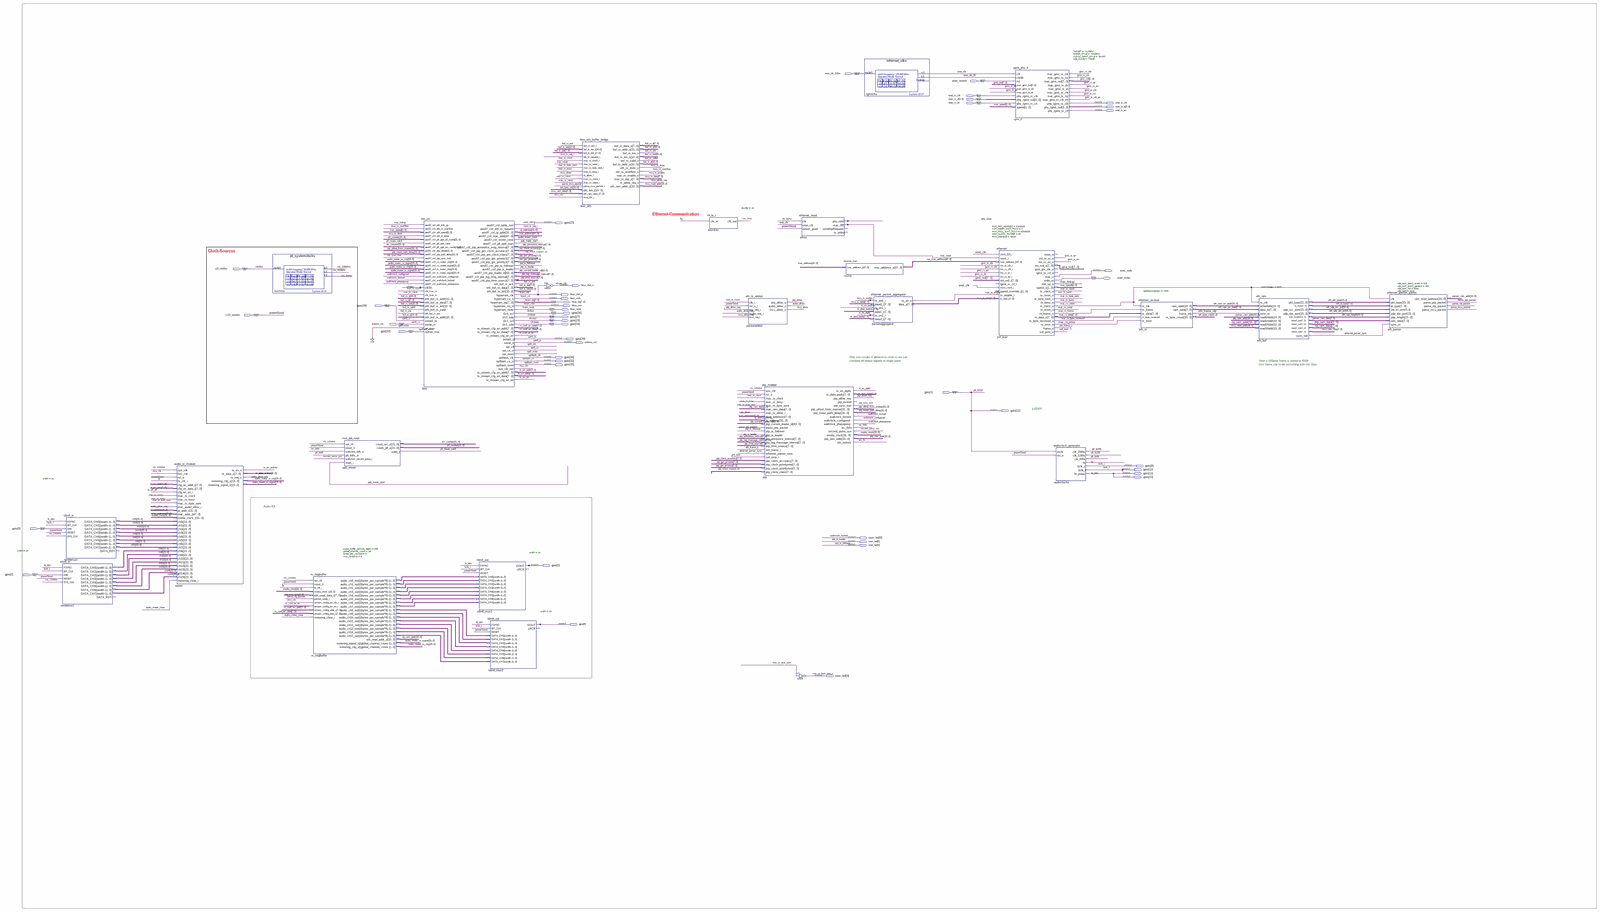
[diagram p0: schematic sheet, whole]
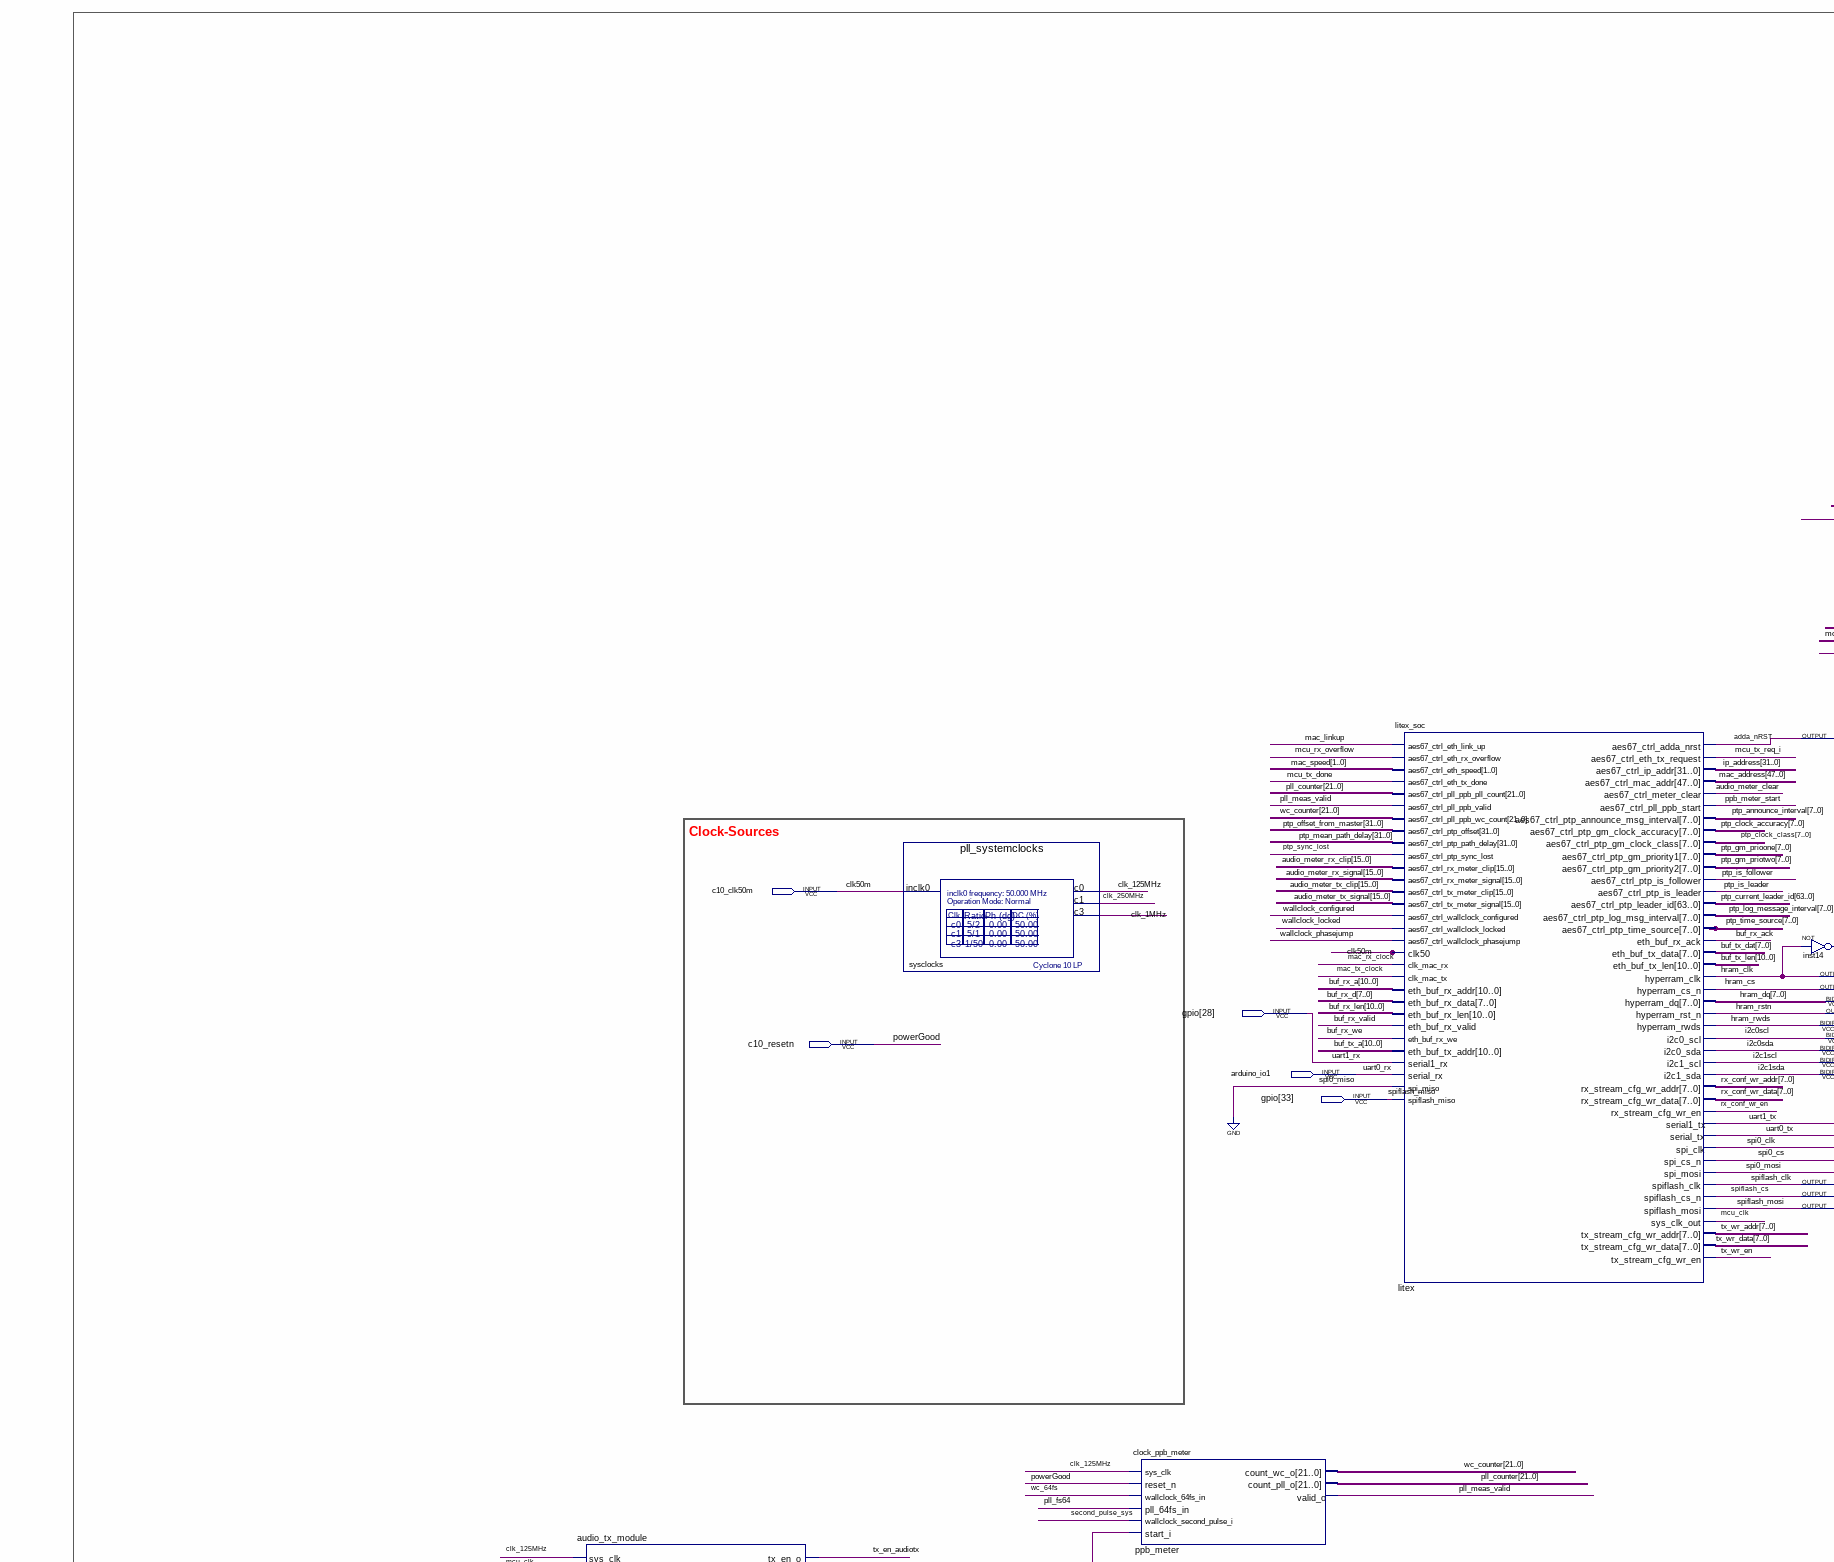
[diagram p1: schematic sheet, upper left part]
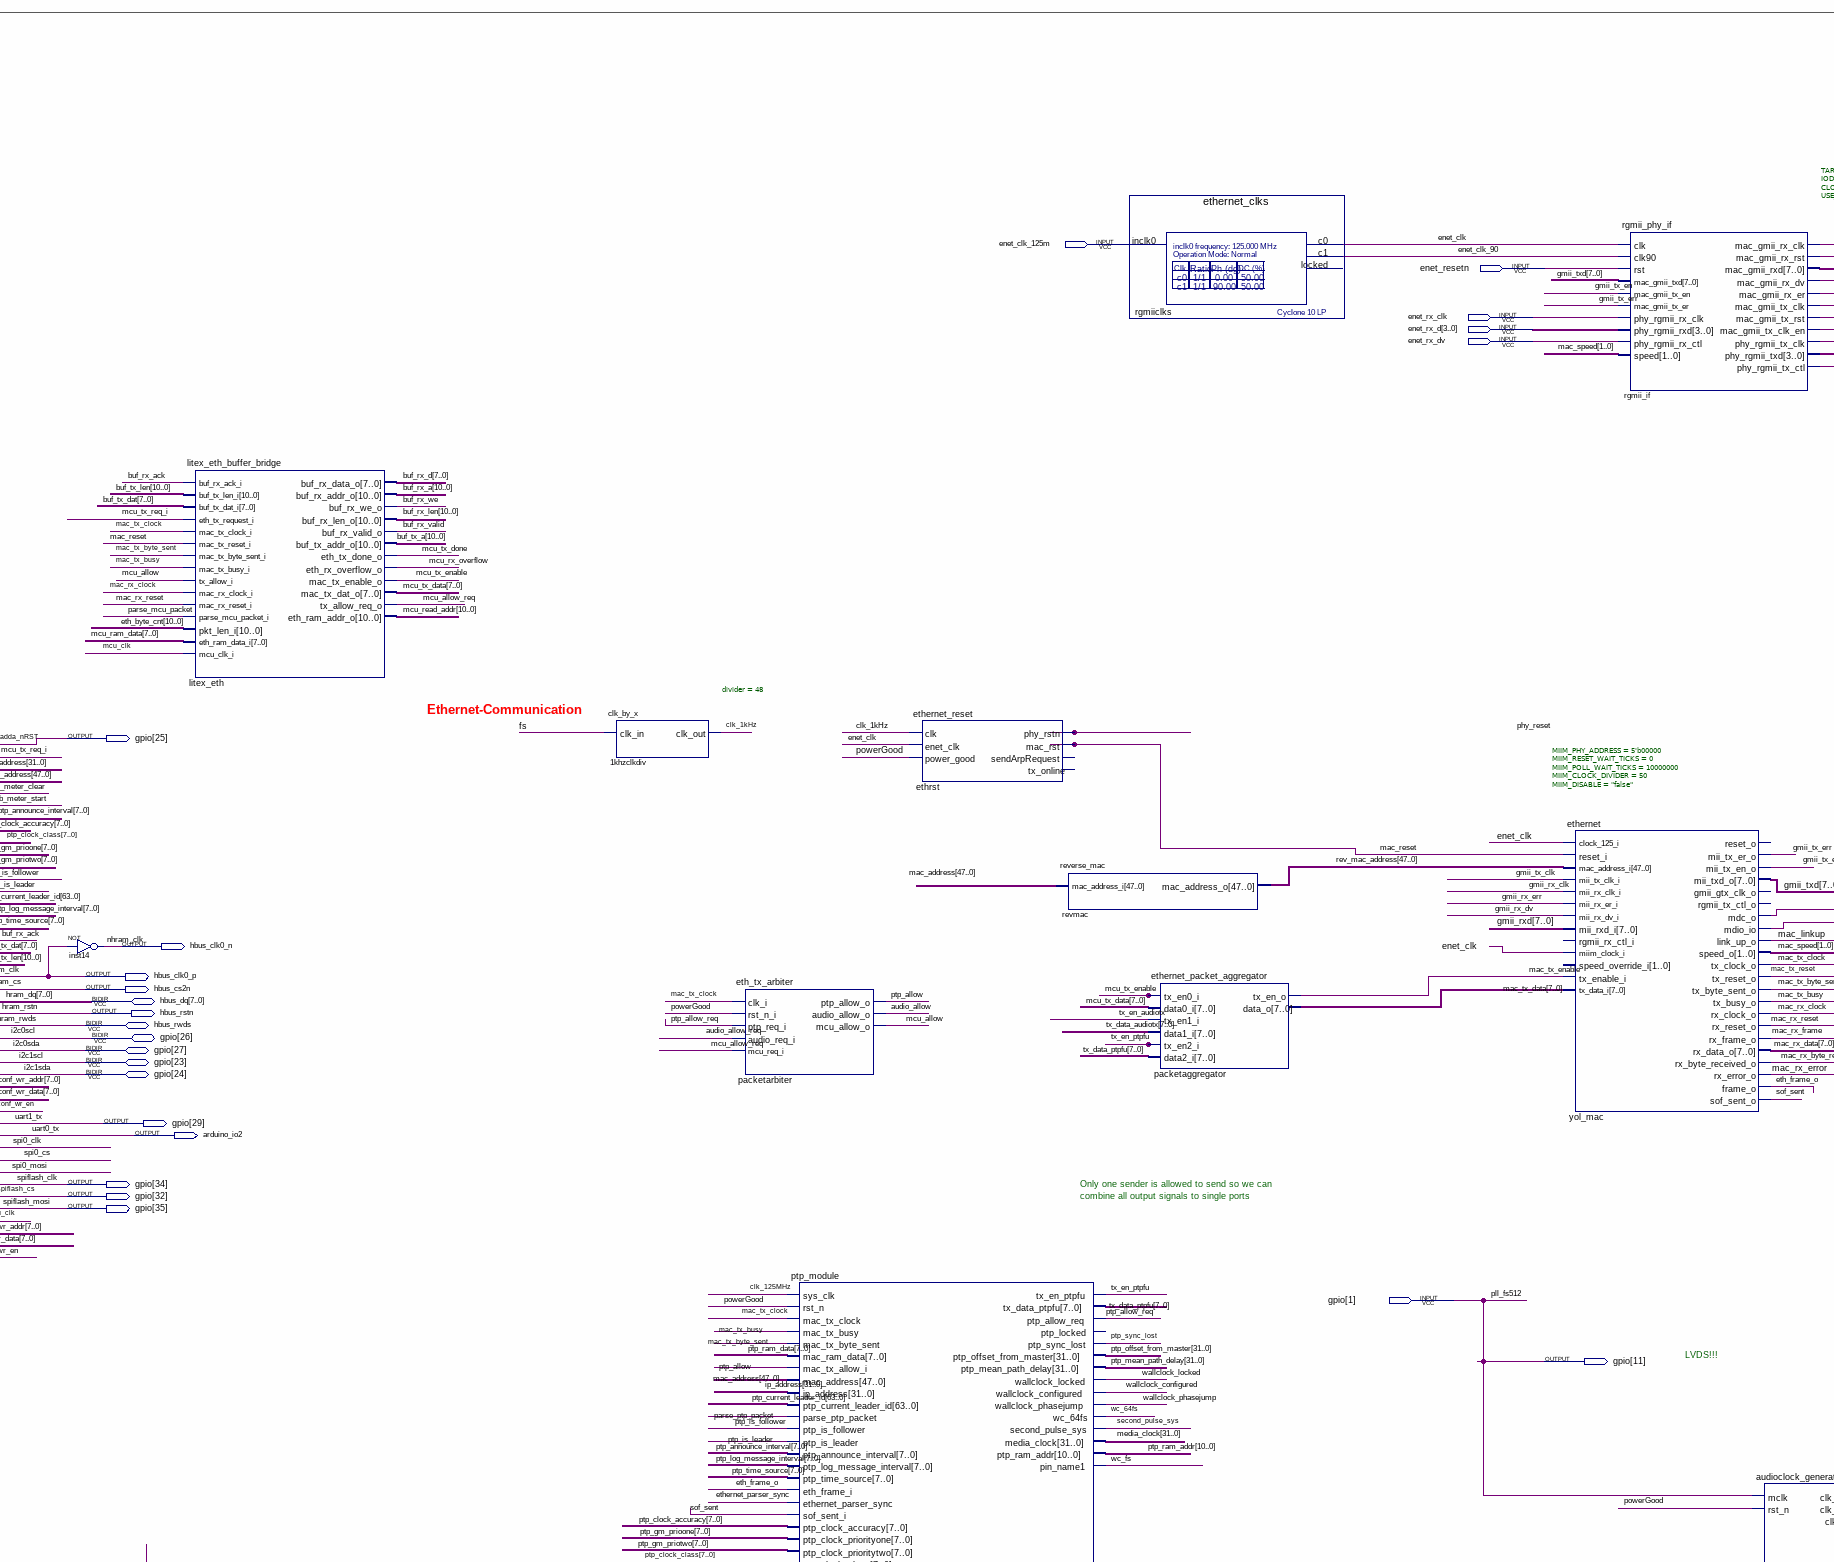
[diagram p2: schematic sheet, upper centre part]
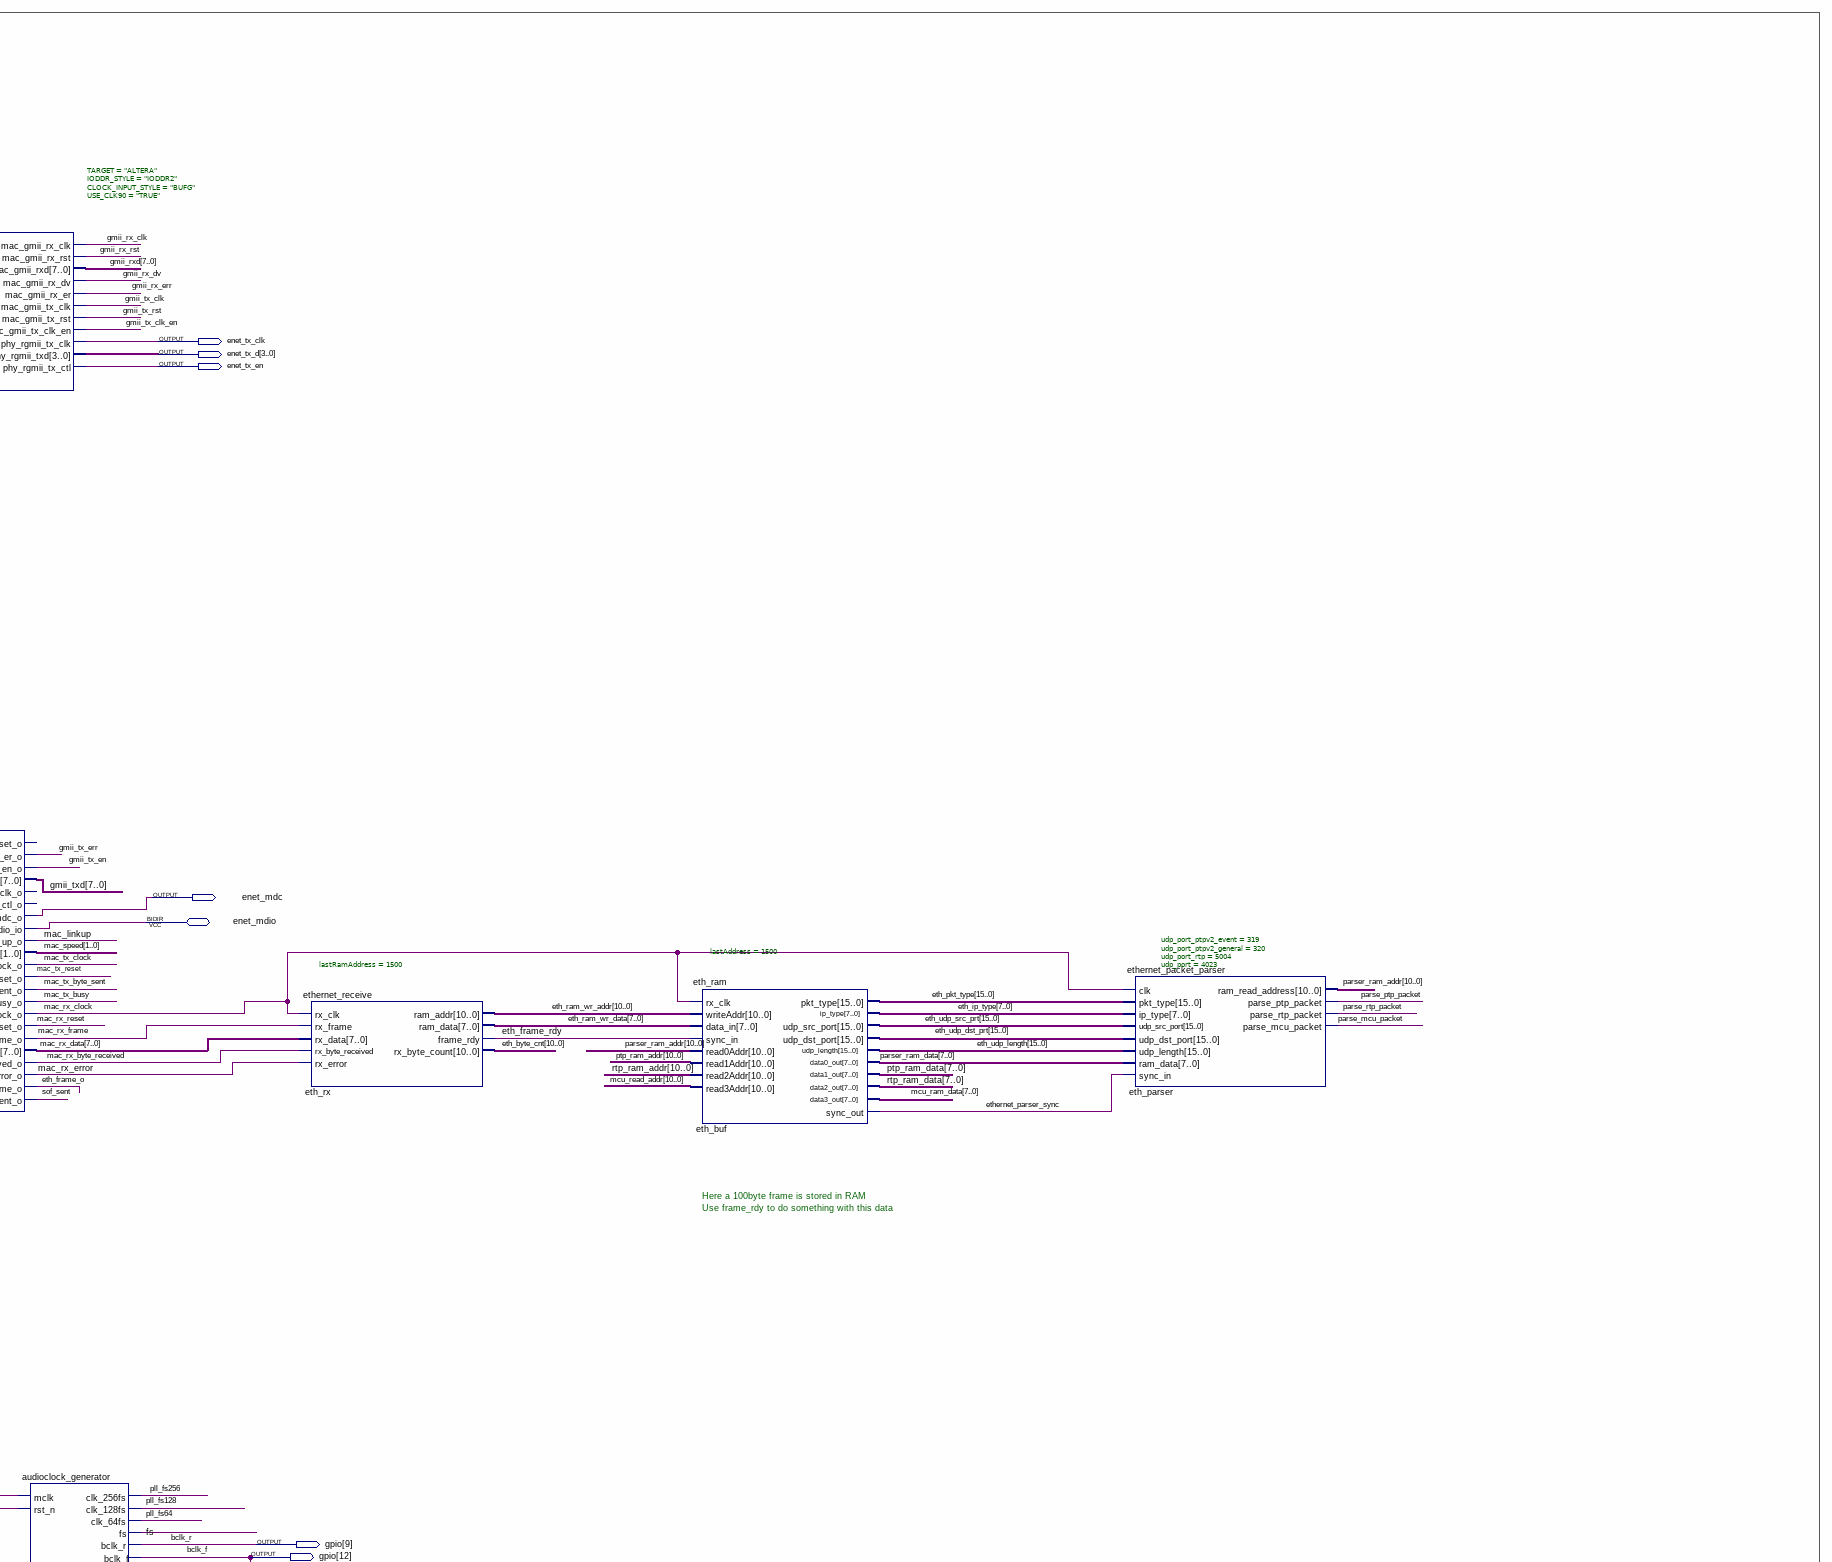
[diagram p3: schematic sheet, upper right part]
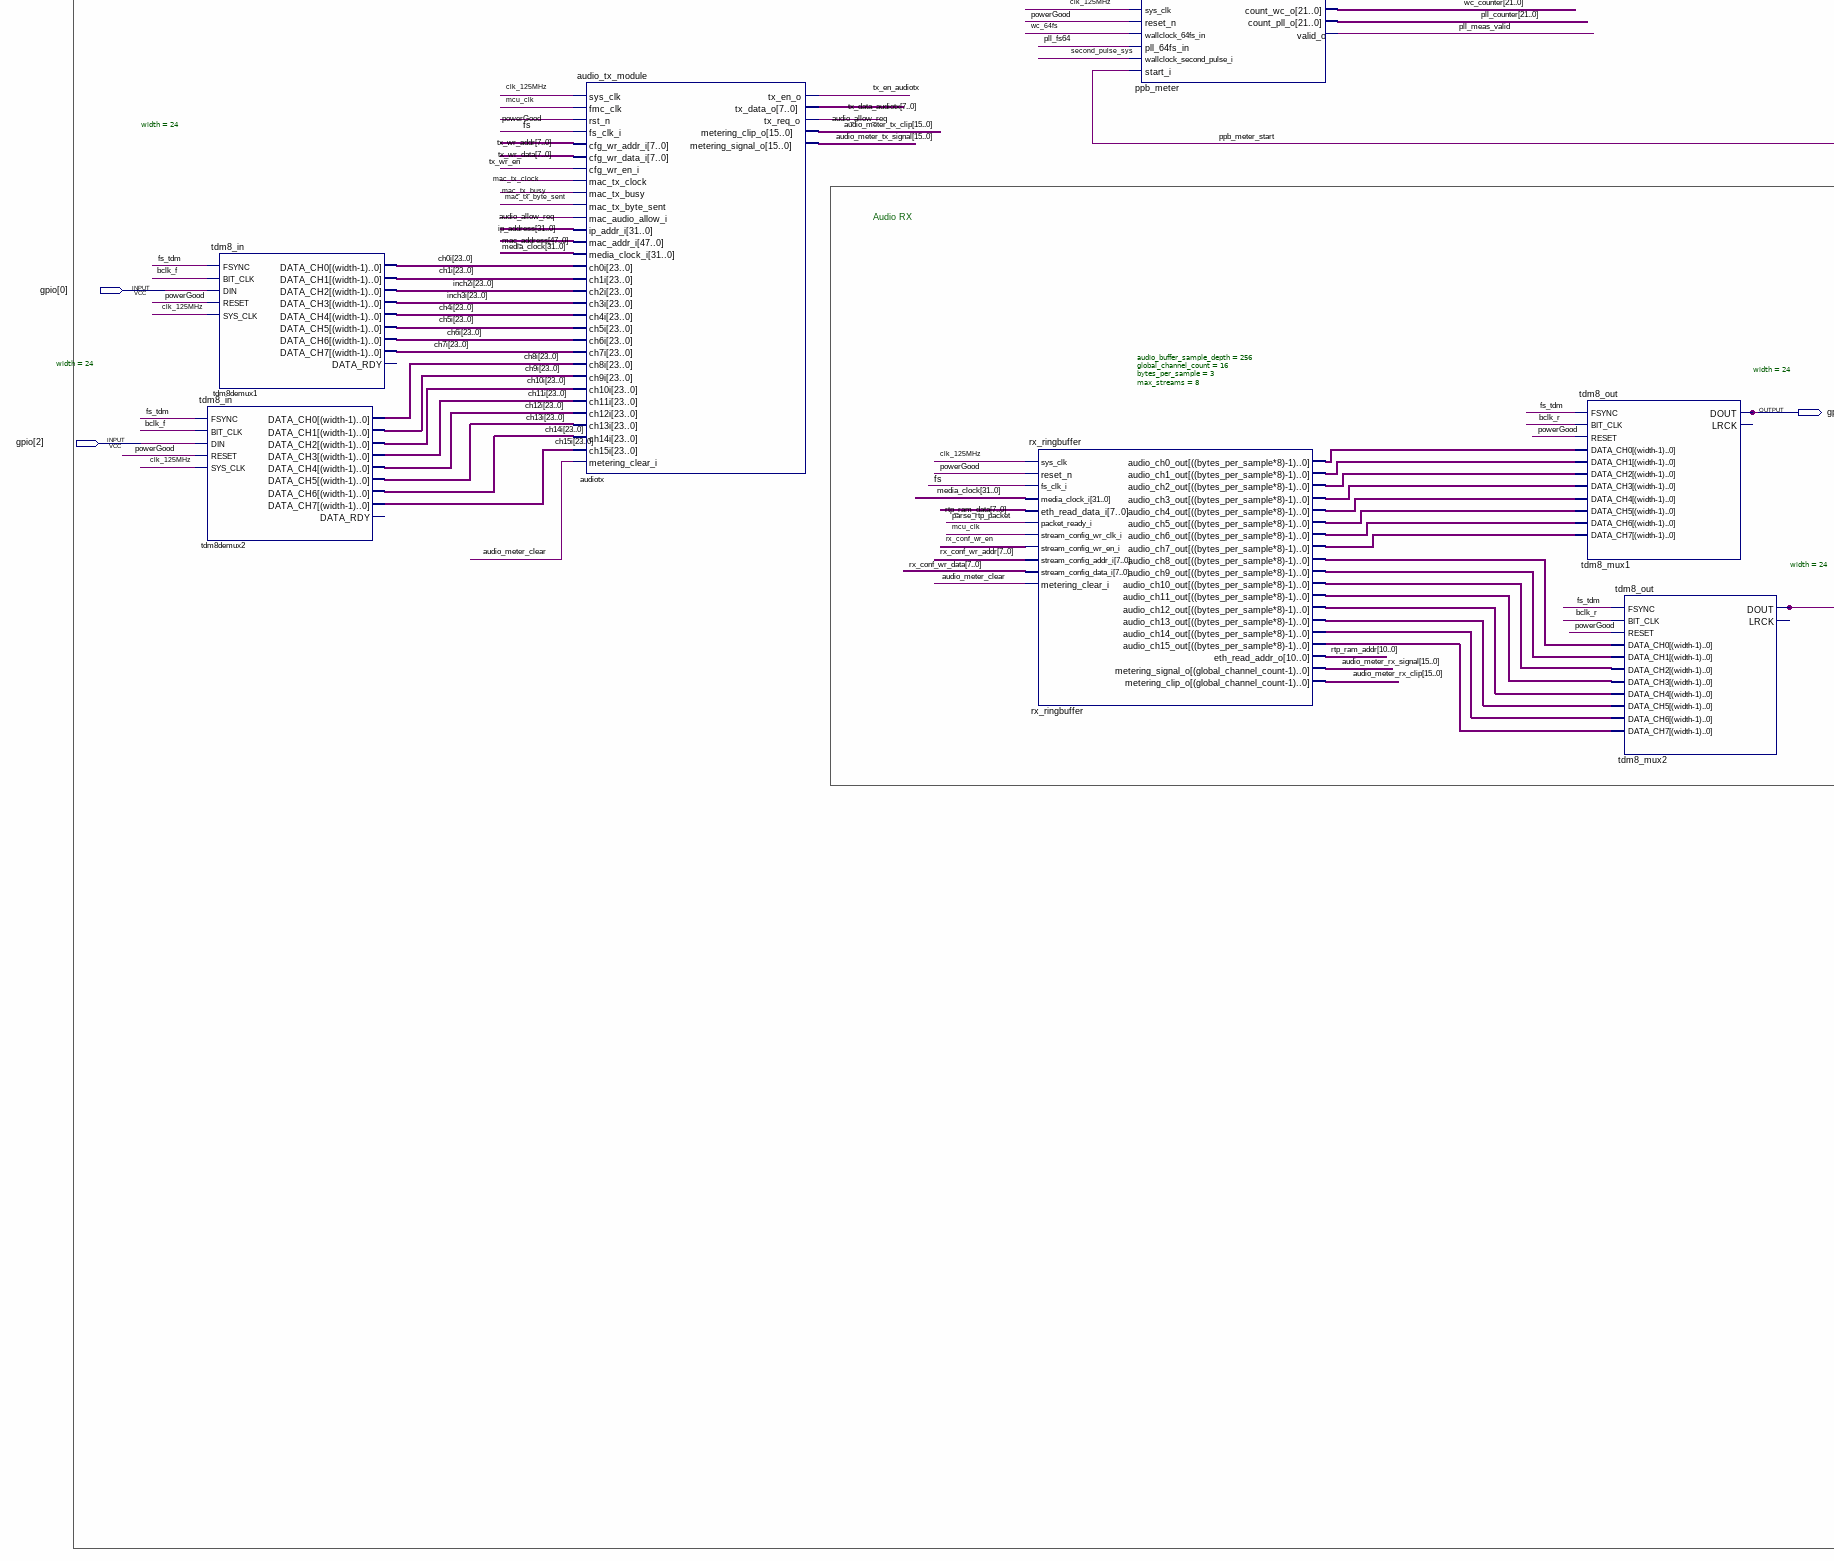
[diagram p4: schematic sheet, lower left part]
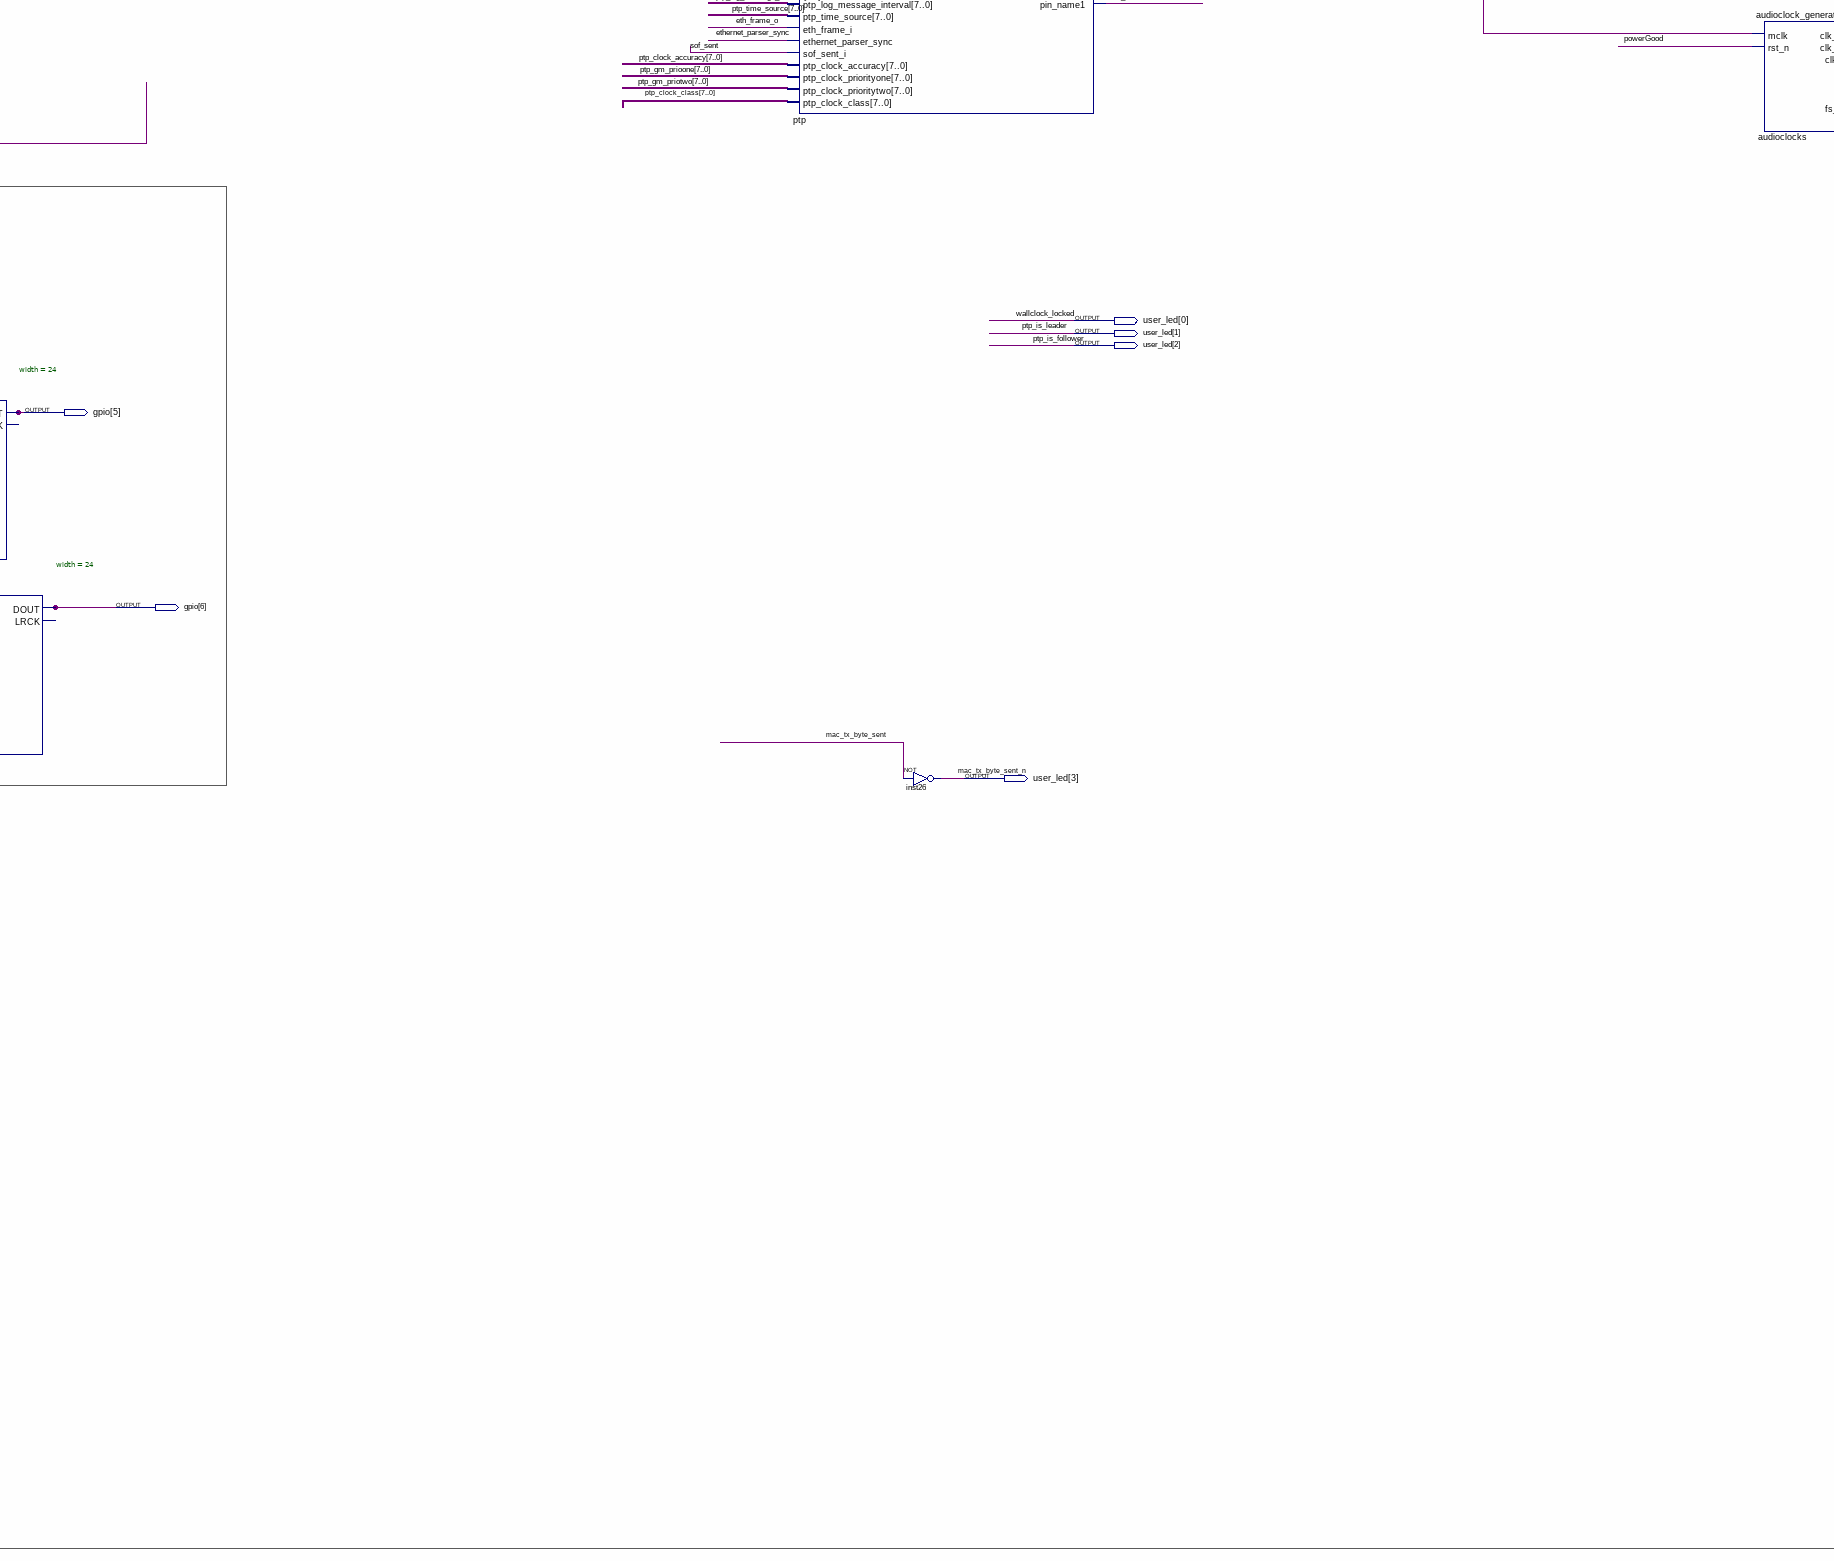
[diagram p5: schematic sheet, lower centre part]
// Quartus schematic FPGA.bdf as structural Verilog: 25 symbols, 45 pins
module FPGA (
  input  enet_clk_125m,
  input  enet_resetn,
  input  enet_rx_clk,
  input  [3:0] enet_rx_d,
  input  enet_rx_dv,
  input  c10_clk50m,
  inout  [35:0] gpio,
  input  c10_resetn,
  input  arduino_io1,
  inout  enet_mdio,
  inout  [7:0] hbus_dq,
  inout  hbus_rwds,
  output enet_tx_clk,
  output [3:0] enet_tx_d,
  output enet_tx_en,
  output enet_mdc,
  output hbus_clk0_n,
  output hbus_clk0_p,
  output hbus_cs2n,
  output hbus_rstn,
  output arduino_io2,
  output [3:0] user_led
);

  wire audio_allow, audio_allow_req, audio_meter_clear, buf_rx_ack, buf_rx_valid, buf_rx_we, clk_1kHz,
       clk_1MHz, clk_125MHz, clk_250MHz, enet_clk, enet_clk_90, eth_frame_o, eth_frame_rdy,
       ethernet_parser_sync, fs, gmii_rx_clk, gmii_rx_dv, gmii_rx_err, gmii_rx_rst, gmii_tx_clk,
       gmii_tx_clk_en, gmii_tx_en, gmii_tx_err, gmii_tx_rst, mac_linkup, mac_reset, mac_rx_byte_received,
       mac_rx_clock, mac_rx_error, mac_rx_frame, mac_rx_reset, mac_tx_busy, mac_tx_byte_sent, mac_tx_clock,
       mac_tx_enable, mac_tx_reset, mcu_allow, mcu_allow_req, mcu_clk, mcu_rx_overflow, mcu_tx_done,
       mcu_tx_enable, mcu_tx_req_i, parse_mcu_packet, parse_ptp_packet, parse_rtp_packet, phy_reset,
       pll_fs64, pll_fs128, pll_fs256, pll_meas_valid, ppb_meter_start, ptp_allow, ptp_allow_req,
       ptp_sync_lost, rx_conf_wr_en, second_pulse_sys, sof_sent, spi0_clk, spi0_cs, spi0_mosi, tx_en_audiotx,
       tx_en_ptpfu, tx_wr_en, wallclock_configured, wallclock_phasejump, wc_64fs, wc_fs;
  wire [1:0] mac_speed;
  wire [7:0] buf_rx_d, buf_tx_dat, eth_ip_type, eth_ram_wr_data, gmii_rxd, gmii_txd, mac_rx_data,
       mac_tx_data, mcu_ram_data, mcu_tx_data, parser_ram_data, ptp_announce_interval, ptp_clock_accuracy,
       ptp_clock_class, ptp_gm_prioone, ptp_gm_priotwo, ptp_log_message_interval, ptp_ram_data,
       ptp_time_source, rtp_ram_data, rx_conf_wr_addr, rx_conf_wr_data, tx_data_audiotx, tx_data_ptpfu,
       tx_wr_addr, tx_wr_data;
  wire [10:0] buf_rx_a, buf_rx_len, buf_tx_a, buf_tx_len, eth_byte_cnt, eth_ram_wr_addr, mcu_read_addr,
       parser_ram_addr, ptp_ram_addr, rtp_ram_addr;
  wire [15:0] audio_meter_rx_clip, audio_meter_rx_signal, audio_meter_tx_clip, audio_meter_tx_signal,
       eth_pkt_type, eth_udp_dst_prt, eth_udp_length, eth_udp_src_prt;
  wire [21:0] pll_counter, wc_counter;
  wire [23:0] ch0i, ch1i, ch4i, ch5i, ch6i, ch7i, ch8i, ch9i, ch10i, ch11i, ch12i, ch13i, ch14i, ch15i,
       inch2i, inch3i, rx_ringbuffer_audio_ch0_out, rx_ringbuffer_audio_ch1_out, rx_ringbuffer_audio_ch2_out,
       rx_ringbuffer_audio_ch3_out, rx_ringbuffer_audio_ch4_out, rx_ringbuffer_audio_ch5_out,
       rx_ringbuffer_audio_ch6_out, rx_ringbuffer_audio_ch7_out, rx_ringbuffer_audio_ch8_out,
       rx_ringbuffer_audio_ch9_out, rx_ringbuffer_audio_ch10_out, rx_ringbuffer_audio_ch11_out,
       rx_ringbuffer_audio_ch12_out, rx_ringbuffer_audio_ch13_out, rx_ringbuffer_audio_ch14_out,
       rx_ringbuffer_audio_ch15_out;
  wire [31:0] ip_address, media_clock, ptp_mean_path_delay, ptp_offset_from_master;
  wire [47:0] mac_address, rev_mac_address;
  wire [63:0] ptp_current_leader_id;

  tdm8_in #(.width(24)) tdm8demux1 (
    .FSYNC(gpio[13]), .BIT_CLK(gpio[12]), .DIN(gpio[0]), .RESET(c10_resetn), .SYS_CLK(clk_125MHz),
    .DATA_CH0(ch0i), .DATA_CH1(ch1i), .DATA_CH2(inch2i), .DATA_CH3(inch3i), .DATA_CH4(ch4i), .DATA_CH5(ch5i),
    .DATA_CH6(ch6i), .DATA_CH7(ch7i));  // open: DATA_RDY
  tdm8_in #(.width(24)) tdm8demux2 (
    .FSYNC(gpio[13]), .BIT_CLK(gpio[12]), .DIN(gpio[2]), .RESET(c10_resetn), .SYS_CLK(clk_125MHz),
    .DATA_CH0(ch8i), .DATA_CH1(ch9i), .DATA_CH2(ch10i), .DATA_CH3(ch11i), .DATA_CH4(ch12i), .DATA_CH5(ch13i),
    .DATA_CH6(ch14i), .DATA_CH7(ch15i));  // open: DATA_RDY
  audio_tx_module audiotx (
    .sys_clk(clk_125MHz), .fmc_clk(mcu_clk), .rst_n(c10_resetn), .fs_clk_i(fs), .cfg_wr_addr_i(tx_wr_addr),
    .cfg_wr_data_i(tx_wr_data), .cfg_wr_en_i(tx_wr_en), .mac_tx_clock(mac_tx_clock),
    .mac_tx_busy(mac_tx_busy), .mac_tx_byte_sent(mac_tx_byte_sent), .mac_audio_allow_i(audio_allow_req),
    .ip_addr_i(ip_address), .mac_addr_i(mac_address), .media_clock_i(media_clock), .ch0i(ch0i), .ch1i(ch1i),
    .ch2i(inch2i), .ch3i(inch3i), .ch4i(ch4i), .ch5i(ch5i), .ch6i(ch6i), .ch7i(ch7i), .ch8i(ch8i),
    .ch9i(ch9i), .ch10i(ch10i), .ch11i(ch11i), .ch12i(ch12i), .ch13i(ch13i), .ch14i(ch14i), .ch15i(ch15i),
    .metering_clear_i(audio_meter_clear), .tx_en_o(tx_en_audiotx), .tx_data_o(tx_data_audiotx),
    .tx_req_o(audio_allow_req), .metering_clip_o(audio_meter_tx_clip),
    .metering_signal_o(audio_meter_tx_signal));
  pll_systemclocks sysclocks (.inclk0(c10_clk50m), .c0(clk_125MHz), .c1(clk_250MHz), .c3(clk_1MHz));
  rx_ringbuffer #(.audio_buffer_sample_depth(256), .global_channel_count(16), .bytes_per_sample(3), .max_streams(8)) rx_ringbuffer (
    .sys_clk(clk_125MHz), .reset_n(c10_resetn), .fs_clk_i(fs), .media_clock_i(media_clock),
    .eth_read_data_i(rtp_ram_data), .packet_ready_i(parse_rtp_packet), .stream_config_wr_clk_i(mcu_clk),
    .stream_config_wr_en_i(rx_conf_wr_en), .stream_config_addr_i(rx_conf_wr_addr),
    .stream_config_data_i(rx_conf_wr_data), .metering_clear_i(audio_meter_clear),
    .audio_ch0_out(rx_ringbuffer_audio_ch0_out), .audio_ch1_out(rx_ringbuffer_audio_ch1_out),
    .audio_ch2_out(rx_ringbuffer_audio_ch2_out), .audio_ch3_out(rx_ringbuffer_audio_ch3_out),
    .audio_ch4_out(rx_ringbuffer_audio_ch4_out), .audio_ch5_out(rx_ringbuffer_audio_ch5_out),
    .audio_ch6_out(rx_ringbuffer_audio_ch6_out), .audio_ch7_out(rx_ringbuffer_audio_ch7_out),
    .audio_ch8_out(rx_ringbuffer_audio_ch8_out), .audio_ch9_out(rx_ringbuffer_audio_ch9_out),
    .audio_ch10_out(rx_ringbuffer_audio_ch10_out), .audio_ch11_out(rx_ringbuffer_audio_ch11_out),
    .audio_ch12_out(rx_ringbuffer_audio_ch12_out), .audio_ch13_out(rx_ringbuffer_audio_ch13_out),
    .audio_ch14_out(rx_ringbuffer_audio_ch14_out), .audio_ch15_out(rx_ringbuffer_audio_ch15_out),
    .eth_read_addr_o(rtp_ram_addr), .metering_signal_o(audio_meter_rx_signal),
    .metering_clip_o(audio_meter_rx_clip));
  clock_ppb_meter ppb_meter (
    .sys_clk(clk_125MHz), .reset_n(c10_resetn), .wallclock_64fs_in(wc_64fs), .pll_64fs_in(pll_fs64),
    .wallclock_second_pulse_i(second_pulse_sys), .start_i(ppb_meter_start), .count_wc_o(wc_counter),
    .count_pll_o(pll_counter), .valid_o(pll_meas_valid));
  litex_soc litex (
    .aes67_ctrl_eth_link_up(mac_linkup), .aes67_ctrl_eth_rx_overflow(mcu_rx_overflow),
    .aes67_ctrl_eth_speed(mac_speed), .aes67_ctrl_eth_tx_done(mcu_tx_done),
    .aes67_ctrl_pll_ppb_pll_count(pll_counter), .aes67_ctrl_pll_ppb_valid(pll_meas_valid),
    .aes67_ctrl_pll_ppb_wc_count(wc_counter), .aes67_ctrl_ptp_offset(ptp_offset_from_master),
    .aes67_ctrl_ptp_path_delay(ptp_mean_path_delay), .aes67_ctrl_ptp_sync_lost(ptp_sync_lost),
    .aes67_ctrl_rx_meter_clip(audio_meter_rx_clip), .aes67_ctrl_rx_meter_signal(audio_meter_rx_signal),
    .aes67_ctrl_tx_meter_clip(audio_meter_tx_clip), .aes67_ctrl_tx_meter_signal(audio_meter_tx_signal),
    .aes67_ctrl_wallclock_configured(wallclock_configured), .aes67_ctrl_wallclock_locked(user_led[0]),
    .aes67_ctrl_wallclock_phasejump(wallclock_phasejump), .clk50(c10_clk50m), .clk_mac_rx(mac_rx_clock),
    .clk_mac_tx(mac_tx_clock), .eth_buf_rx_addr(buf_rx_a), .eth_buf_rx_data(buf_rx_d),
    .eth_buf_rx_len(buf_rx_len), .eth_buf_rx_valid(buf_rx_valid), .eth_buf_rx_we(buf_rx_we),
    .eth_buf_tx_addr(buf_tx_a), .serial1_rx(gpio[28]), .serial_rx(arduino_io1), .spi_miso(1'b0),
    .spiflash_miso(gpio[33]), .aes67_ctrl_adda_nrst(gpio[25]), .aes67_ctrl_eth_tx_request(mcu_tx_req_i),
    .aes67_ctrl_ip_addr(ip_address), .aes67_ctrl_mac_addr(mac_address),
    .aes67_ctrl_meter_clear(audio_meter_clear), .aes67_ctrl_pll_ppb_start(ppb_meter_start),
    .aes67_ctrl_ptp_announce_msg_interval(ptp_announce_interval),
    .aes67_ctrl_ptp_gm_clock_accuracy(ptp_clock_accuracy), .aes67_ctrl_ptp_gm_clock_class(ptp_clock_class),
    .aes67_ctrl_ptp_gm_priority1(ptp_gm_prioone), .aes67_ctrl_ptp_gm_priority2(ptp_gm_priotwo),
    .aes67_ctrl_ptp_is_follower(user_led[2]), .aes67_ctrl_ptp_is_leader(user_led[1]),
    .aes67_ctrl_ptp_leader_id(ptp_current_leader_id),
    .aes67_ctrl_ptp_log_msg_interval(ptp_log_message_interval), .aes67_ctrl_ptp_time_source(ptp_time_source),
    .eth_buf_rx_ack(buf_rx_ack), .eth_buf_tx_data(buf_tx_dat), .eth_buf_tx_len(buf_tx_len),
    .hyperram_clk(hbus_clk0_p), .hyperram_cs_n(hbus_cs2n), .hyperram_rst_n(hbus_rstn),
    .rx_stream_cfg_wr_addr(rx_conf_wr_addr), .rx_stream_cfg_wr_data(rx_conf_wr_data),
    .rx_stream_cfg_wr_en(rx_conf_wr_en), .serial1_tx(gpio[29]), .serial_tx(arduino_io2), .spi_clk(spi0_clk),
    .spi_cs_n(spi0_cs), .spi_mosi(spi0_mosi), .spiflash_clk(gpio[34]), .spiflash_cs_n(gpio[32]),
    .spiflash_mosi(gpio[35]), .sys_clk_out(mcu_clk), .tx_stream_cfg_wr_addr(tx_wr_addr),
    .tx_stream_cfg_wr_data(tx_wr_data), .tx_stream_cfg_wr_en(tx_wr_en), .hyperram_dq(hbus_dq),
    .hyperram_rwds(hbus_rwds), .i2c0_scl(gpio[26]), .i2c0_sda(gpio[27]), .i2c1_scl(gpio[23]),
    .i2c1_sda(gpio[24]));
  tdm8_out #(.width(24)) tdm8_mux1 (
    .FSYNC(gpio[13]), .BIT_CLK(gpio[9]), .RESET(c10_resetn), .DATA_CH0(rx_ringbuffer_audio_ch0_out),
    .DATA_CH1(rx_ringbuffer_audio_ch1_out), .DATA_CH2(rx_ringbuffer_audio_ch2_out),
    .DATA_CH3(rx_ringbuffer_audio_ch3_out), .DATA_CH4(rx_ringbuffer_audio_ch4_out),
    .DATA_CH5(rx_ringbuffer_audio_ch5_out), .DATA_CH6(rx_ringbuffer_audio_ch6_out),
    .DATA_CH7(rx_ringbuffer_audio_ch7_out), .DOUT(gpio[5]));  // open: LRCK
  tdm8_out #(.width(24)) tdm8_mux2 (
    .FSYNC(gpio[13]), .BIT_CLK(gpio[9]), .RESET(c10_resetn), .DATA_CH0(rx_ringbuffer_audio_ch8_out),
    .DATA_CH1(rx_ringbuffer_audio_ch9_out), .DATA_CH2(rx_ringbuffer_audio_ch10_out),
    .DATA_CH3(rx_ringbuffer_audio_ch11_out), .DATA_CH4(rx_ringbuffer_audio_ch12_out),
    .DATA_CH5(rx_ringbuffer_audio_ch13_out), .DATA_CH6(rx_ringbuffer_audio_ch14_out),
    .DATA_CH7(rx_ringbuffer_audio_ch15_out), .DOUT(gpio[6]));  // open: LRCK
  not inst14 (hbus_clk0_n, hbus_clk0_p);
  litex_eth_buffer_bridge litex_eth (
    .buf_rx_ack_i(buf_rx_ack), .buf_tx_len_i(buf_tx_len), .buf_tx_dat_i(buf_tx_dat),
    .eth_tx_request_i(mcu_tx_req_i), .mac_tx_clock_i(mac_tx_clock), .mac_tx_reset_i(mac_reset),
    .mac_tx_byte_sent_i(mac_tx_byte_sent), .mac_tx_busy_i(mac_tx_busy), .tx_allow_i(mcu_allow),
    .mac_rx_clock_i(mac_rx_clock), .mac_rx_reset_i(mac_rx_reset), .parse_mcu_packet_i(parse_mcu_packet),
    .pkt_len_i(eth_byte_cnt), .eth_ram_data_i(mcu_ram_data), .mcu_clk_i(mcu_clk), .buf_rx_data_o(buf_rx_d),
    .buf_rx_addr_o(buf_rx_a), .buf_rx_we_o(buf_rx_we), .buf_rx_len_o(buf_rx_len),
    .buf_rx_valid_o(buf_rx_valid), .buf_tx_addr_o(buf_tx_a), .eth_tx_done_o(mcu_tx_done),
    .eth_rx_overflow_o(mcu_rx_overflow), .mac_tx_enable_o(mcu_tx_enable), .mac_tx_dat_o(mcu_tx_data),
    .tx_allow_req_o(mcu_allow_req), .eth_ram_addr_o(mcu_read_addr));
  clk_by_x #(.divider(48)) u_1khzclkdiv (.clk_in(fs), .clk_out(clk_1kHz));
  eth_tx_arbiter packetarbiter (
    .clk_i(mac_tx_clock), .rst_n_i(c10_resetn), .ptp_req_i(ptp_allow_req), .audio_req_i(audio_allow_req),
    .mcu_req_i(mcu_allow_req), .ptp_allow_o(ptp_allow), .audio_allow_o(audio_allow), .mcu_allow_o(mcu_allow));
  ptp_module ptp (
    .sys_clk(clk_125MHz), .rst_n(c10_resetn), .mac_tx_clock(mac_tx_clock), .mac_tx_busy(mac_tx_busy),
    .mac_tx_byte_sent(mac_tx_byte_sent), .mac_ram_data(ptp_ram_data), .mac_tx_allow_i(ptp_allow),
    .mac_address(mac_address), .ip_address(ip_address), .ptp_current_leader_id(ptp_current_leader_id),
    .parse_ptp_packet(parse_ptp_packet), .ptp_is_follower(user_led[2]), .ptp_is_leader(user_led[1]),
    .ptp_announce_interval(ptp_announce_interval), .ptp_log_message_interval(ptp_log_message_interval),
    .ptp_time_source(ptp_time_source), .eth_frame_i(eth_frame_o),
    .ethernet_parser_sync(ethernet_parser_sync), .sof_sent_i(sof_sent),
    .ptp_clock_accuracy(ptp_clock_accuracy), .ptp_clock_priorityone(ptp_gm_prioone),
    .ptp_clock_prioritytwo(ptp_gm_priotwo), .ptp_clock_class(ptp_clock_class), .tx_en_ptpfu(tx_en_ptpfu),
    .tx_data_ptpfu(tx_data_ptpfu), .ptp_allow_req(ptp_allow_req), .ptp_sync_lost(ptp_sync_lost),
    .ptp_offset_from_master(ptp_offset_from_master), .ptp_mean_path_delay(ptp_mean_path_delay),
    .wallclock_locked(user_led[0]), .wallclock_configured(wallclock_configured),
    .wallclock_phasejump(wallclock_phasejump), .wc_64fs(wc_64fs), .second_pulse_sys(second_pulse_sys),
    .media_clock(media_clock), .ptp_ram_addr(ptp_ram_addr), .pin_name1(wc_fs));  // open: ptp_locked
  ethernet_reset ethrst (
    .clk(clk_1kHz), .enet_clk(enet_clk), .power_good(c10_resetn), .phy_rstn(phy_reset), .mac_rst(mac_reset));  // open: sendArpRequest, tx_online
  not inst26 (user_led[3], mac_tx_byte_sent);
  reverse_mac revmac (.mac_address_i(mac_address), .mac_address_o(rev_mac_address));
  ethernet_clks rgmiiclks (.inclk0(enet_clk_125m), .c0(enet_clk), .c1(enet_clk_90));  // open: locked
  ethernet_packet_aggregator packetaggregator (
    .tx_en0_i(mcu_tx_enable), .data0_i(mcu_tx_data), .tx_en1_i(tx_en_audiotx), .data1_i(tx_data_audiotx),
    .tx_en2_i(tx_en_ptpfu), .data2_i(tx_data_ptpfu), .tx_en_o(mac_tx_enable), .data_o(mac_tx_data));
  ethernet #(.MIIM_PHY_ADDRESS(5'b00000), .MIIM_RESET_WAIT_TICKS(0), .MIIM_POLL_WAIT_TICKS(10000000), .MIIM_CLOCK_DIVIDER(50), .MIIM_DISABLE("false")) yol_mac (
    .clock_125_i(enet_clk), .reset_i(mac_reset), .mac_address_i(rev_mac_address), .mii_tx_clk_i(gmii_tx_clk),
    .mii_rx_clk_i(gmii_rx_clk), .mii_rx_er_i(gmii_rx_err), .mii_rx_dv_i(gmii_rx_dv), .mii_rxd_i(gmii_rxd),
    .miim_clock_i(enet_clk), .tx_enable_i(mac_tx_enable), .tx_data_i(mac_tx_data), .mii_tx_er_o(gmii_tx_err),
    .mii_tx_en_o(gmii_tx_en), .mii_txd_o(gmii_txd), .mdc_o(enet_mdc), .link_up_o(mac_linkup),
    .speed_o(mac_speed), .tx_clock_o(mac_tx_clock), .tx_reset_o(mac_tx_reset),
    .tx_byte_sent_o(mac_tx_byte_sent), .tx_busy_o(mac_tx_busy), .rx_clock_o(mac_rx_clock),
    .rx_reset_o(mac_rx_reset), .rx_frame_o(mac_rx_frame), .rx_data_o(mac_rx_data),
    .rx_byte_received_o(mac_rx_byte_received), .rx_error_o(mac_rx_error), .frame_o(eth_frame_o),
    .sof_sent_o(sof_sent), .mdio_io(enet_mdio));  // open: rgmii_rx_ctl_i, speed_override_i, reset_o, gmii_gtx_clk_o, rgmii_tx_ctl_o
  rgmii_phy_if #(.TARGET("ALTERA"), .IODDR_STYLE("IODDR2"), .CLOCK_INPUT_STYLE("BUFG"), .USE_CLK90("TRUE")) rgmii_if (
    .clk(enet_clk), .clk90(enet_clk_90), .rst(enet_resetn), .mac_gmii_txd(gmii_txd),
    .mac_gmii_tx_en(gmii_tx_en), .mac_gmii_tx_er(gmii_tx_err), .phy_rgmii_rx_clk(enet_rx_clk),
    .phy_rgmii_rxd(enet_rx_d), .phy_rgmii_rx_ctl(enet_rx_dv), .speed(mac_speed),
    .mac_gmii_rx_clk(gmii_rx_clk), .mac_gmii_rx_rst(gmii_rx_rst), .mac_gmii_rxd(gmii_rxd),
    .mac_gmii_rx_dv(gmii_rx_dv), .mac_gmii_rx_er(gmii_rx_err), .mac_gmii_tx_clk(gmii_tx_clk),
    .mac_gmii_tx_rst(gmii_tx_rst), .mac_gmii_tx_clk_en(gmii_tx_clk_en), .phy_rgmii_tx_clk(enet_tx_clk),
    .phy_rgmii_txd(enet_tx_d), .phy_rgmii_tx_ctl(enet_tx_en));
  audioclock_generator audioclocks (
    .mclk(gpio[1]), .rst_n(c10_resetn), .clk_256fs(pll_fs256), .clk_128fs(pll_fs128), .clk_64fs(pll_fs64),
    .fs(fs), .bclk_r(gpio[9]), .bclk_f(gpio[12]), .fs_pulse(gpio[13]));
  ethernet_receive #(.lastRamAddress(1500)) eth_rx (
    .rx_clk(mac_rx_clock), .rx_frame(mac_rx_frame), .rx_data(mac_rx_data),
    .rx_byte_received(mac_rx_byte_received), .rx_error(mac_rx_error), .ram_addr(eth_ram_wr_addr),
    .ram_data(eth_ram_wr_data), .frame_rdy(eth_frame_rdy), .rx_byte_count(eth_byte_cnt));
  eth_ram #(.lastAddress(1500)) eth_buf (
    .rx_clk(mac_rx_clock), .writeAddr(eth_ram_wr_addr), .data_in(eth_ram_wr_data), .sync_in(eth_frame_rdy),
    .read0Addr(parser_ram_addr), .read1Addr(ptp_ram_addr), .read2Addr(rtp_ram_addr),
    .read3Addr(mcu_read_addr), .pkt_type(eth_pkt_type), .ip_type(eth_ip_type),
    .udp_src_port(eth_udp_src_prt), .udp_dst_port(eth_udp_dst_prt), .udp_length(eth_udp_length),
    .data0_out(parser_ram_data), .data1_out(ptp_ram_data), .data2_out(rtp_ram_data),
    .data3_out(mcu_ram_data), .sync_out(ethernet_parser_sync));
  ethernet_packet_parser #(.udp_port_ptpv2_event(319), .udp_port_ptpv2_general(320), .udp_port_rtp(5004), .udp_port(4023)) eth_parser (
    .clk(mac_rx_clock), .pkt_type(eth_pkt_type), .ip_type(eth_ip_type), .udp_src_port(eth_udp_src_prt),
    .udp_dst_port(eth_udp_dst_prt), .udp_length(eth_udp_length), .ram_data(parser_ram_data),
    .sync_in(ethernet_parser_sync), .ram_read_address(parser_ram_addr), .parse_ptp_packet(parse_ptp_packet),
    .parse_rtp_packet(parse_rtp_packet), .parse_mcu_packet(parse_mcu_packet));

  assign gpio[11:10] = {gpio[1], gpio[13]};

  // Other names for the same wires on the sheet: bclk_r = gpio[9]; clk50m = c10_clk50m; fs_tdm = gpio[13];
  //   pll_fs512 = gpio[1]; bclk_f = gpio[12]; adda_nRST = gpio[25]; uart1_rx = gpio[28]; hram_clk = hbus_clk0_p;
  //   hram_cs = hbus_cs2n; hram_dq[7:0] = hbus_dq; hram_rstn = hbus_rstn; hram_rwds = hbus_rwds; i2c0scl = gpio[26];
  //   i2c0sda = gpio[27]; i2c1scl = gpio[23]; i2c1sda = gpio[24]; mac_tx_byte_sent_n = user_led[3];
  //   nhram_clk = hbus_clk0_n; powerGood = c10_resetn; ptp_is_follower = user_led[2]; ptp_is_leader = user_led[1];
  //   spiflash_clk = gpio[34]; spiflash_cs = gpio[32]; spiflash_miso = gpio[33]; spiflash_mosi = gpio[35];
  //   uart0_rx = arduino_io1; uart0_tx = arduino_io2; uart1_tx = gpio[29]; wallclock_locked = user_led[0]

  // Notes on the sheet:
  //   Ethernet-Communication
  //   Clock-Sources
  //   Only one sender is allowed to send so we can
  //   combine all output signals to single ports
  //   Here a 100byte frame is stored in RAM
  //   Use frame_rdy to do something with this data
  //   LVDS!!!
  //   Audio RX
endmodule
